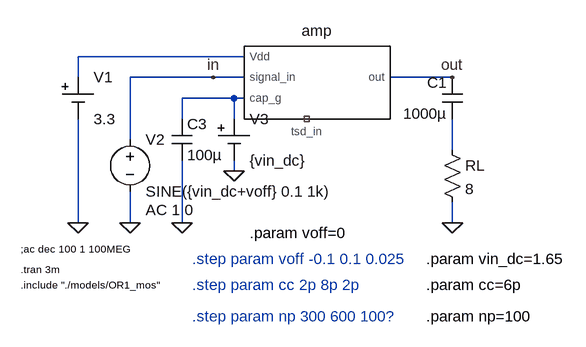
[diagram p0: schematic haruna_ab_test_tb.asc]
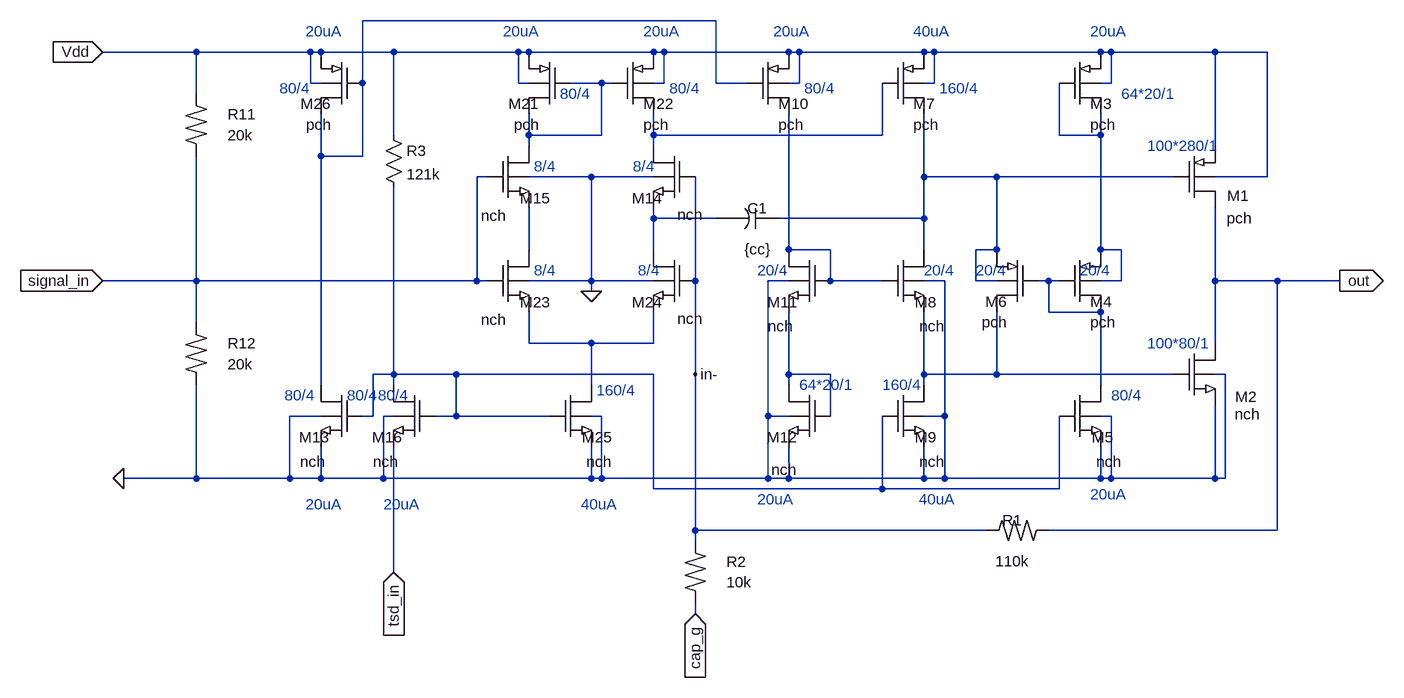
[diagram p1: sub-circuit haruna_ab.asc]
haruna_ab_test_tb.asc, the LTspice schematic file:
Version 4
SHEET 1 1492 1024
WIRE -240 -48 -496 -48
WIRE -496 -16 -496 -48
WIRE -288 -16 -416 -16
WIRE -240 -16 -288 -16
WIRE 80 -16 -16 -16
WIRE -256 16 -336 16
WIRE -240 16 -256 16
WIRE -336 48 -336 16
WIRE -256 48 -256 16
WIRE -416 80 -416 -16
WIRE 80 96 80 48
WIRE -256 128 -256 112
WIRE -496 208 -496 48
WIRE -416 208 -416 160
WIRE -336 208 -336 112
WIRE 80 208 80 176
FLAG -496 208 0
FLAG -336 208 0
FLAG -416 208 0
FLAG 80 208 0
FLAG 80 -16 out
FLAG -288 -16 in
FLAG -256 128 0
SYMBOL Misc\\cell -496 -16 R0
WINDOW 123 0 0 Left 2
WINDOW 39 0 0 Left 2
SYMATTR InstName V1
SYMATTR Value 3.3
SYMBOL cap 96 48 R180
WINDOW 0 24 56 Left 2
WINDOW 3 24 8 Left 2
SYMATTR InstName C1
SYMATTR Value 1000µ
SYMBOL voltage -416 64 R0
WINDOW 123 24 124 Left 2
WINDOW 39 0 0 Left 2
SYMATTR Value2 AC 1 0
SYMATTR InstName V2
SYMATTR Value SINE({vin_dc+voff} 0.1 1k)
SYMBOL haruna_ab -128 -16 R0
SYMATTR InstName amp
SYMBOL cap -352 48 R0
SYMATTR InstName C3
SYMATTR Value 100µ
SYMBOL res 64 80 R0
SYMATTR InstName RL
SYMATTR Value 8
SYMBOL Misc\\cell -256 48 R0
WINDOW 123 0 0 Left 2
WINDOW 39 0 0 Left 2
SYMATTR InstName V3
SYMATTR Value {vin_dc}
TEXT -584 280 Left 1 !.tran 3m
TEXT -584 304 Left 1 !.include "./models/OR1_mos"
TEXT -584 248 Left 1 !;ac dec 100 1 100MEG
TEXT -320 304 Left 2 ;.step param cc 2p 8p 2p
TEXT 40 304 Left 2 !.param cc=6p
TEXT -320 352 Left 2 ;.step param np 300 600 100?
TEXT 40 352 Left 2 !.param np=100
TEXT 40 264 Left 2 !.param vin_dc=1.65
TEXT -320 264 Left 2 ;.step param voff -0.1 0.1 0.025
TEXT -232 224 Left 2 !.param voff=0

haruna_ab.asc, the sub-circuit schematic file:
Version 4
SHEET 1 1492 1024
WIRE 32 -400 -512 -400
WIRE -768 -352 -912 -352
WIRE -592 -352 -768 -352
WIRE -576 -352 -592 -352
WIRE -464 -352 -576 -352
WIRE -272 -352 -464 -352
WIRE -256 -352 -272 -352
WIRE -64 -352 -256 -352
WIRE -48 -352 -64 -352
WIRE 144 -352 -48 -352
WIRE 160 -352 144 -352
WIRE 352 -352 160 -352
WIRE 368 -352 352 -352
WIRE 624 -352 368 -352
WIRE 640 -352 624 -352
WIRE 800 -352 640 -352
WIRE 880 -352 800 -352
WIRE -592 -304 -592 -352
WIRE -576 -304 -592 -304
WIRE -512 -304 -512 -400
WIRE -272 -304 -272 -352
WIRE -256 -304 -272 -304
WIRE -144 -304 -192 -304
WIRE -128 -304 -144 -304
WIRE -48 -304 -48 -352
WIRE -48 -304 -64 -304
WIRE 32 -304 32 -400
WIRE 80 -304 32 -304
WIRE 160 -304 160 -352
WIRE 160 -304 144 -304
WIRE 368 -304 368 -352
WIRE 368 -304 352 -304
WIRE 640 -304 640 -352
WIRE 640 -304 624 -304
WIRE -768 -288 -768 -352
WIRE -464 -224 -464 -352
WIRE -256 -224 -256 -256
WIRE -144 -224 -144 -304
WIRE -144 -224 -256 -224
WIRE -64 -224 -64 -256
WIRE 288 -224 288 -304
WIRE 288 -224 -64 -224
WIRE 560 -224 560 -304
WIRE 624 -224 624 -256
WIRE 624 -224 560 -224
WIRE -256 -208 -256 -224
WIRE -64 -208 -64 -224
WIRE 800 -208 800 -352
WIRE -576 -192 -576 -256
WIRE -512 -192 -512 -304
WIRE -512 -192 -576 -192
WIRE -320 -160 -336 -160
WIRE -160 -160 -256 -160
WIRE -64 -160 -160 -160
WIRE 352 -160 352 -256
WIRE 464 -160 352 -160
WIRE 736 -160 464 -160
WIRE 880 -160 880 -352
WIRE 880 -160 800 -160
WIRE -64 -96 -64 -112
WIRE 32 -96 -64 -96
WIRE 352 -96 352 -160
WIRE 352 -96 128 -96
WIRE -256 -48 -256 -112
WIRE -64 -48 -64 -96
WIRE 144 -48 144 -256
WIRE 208 -48 144 -48
WIRE 352 -48 352 -96
WIRE 464 -48 464 -160
WIRE 464 -48 432 -48
WIRE 624 -48 624 -224
WIRE 656 -48 624 -48
WIRE -768 0 -768 -192
WIRE -768 0 -912 0
WIRE -336 0 -336 -160
WIRE -336 0 -768 0
WIRE -320 0 -336 0
WIRE -160 0 -160 -160
WIRE -160 0 -256 0
WIRE -64 0 -160 0
WIRE 0 0 0 -160
WIRE 144 0 112 0
WIRE 208 0 208 -48
WIRE 208 0 192 0
WIRE 288 0 208 0
WIRE 384 0 352 0
WIRE 432 0 432 -48
WIRE 464 0 432 0
WIRE 544 0 528 0
WIRE 560 0 544 0
WIRE 656 0 656 -48
WIRE 656 0 624 0
WIRE 800 0 800 -112
WIRE 896 0 800 0
WIRE 992 0 896 0
WIRE -160 16 -160 0
WIRE 544 48 544 0
WIRE 624 48 544 48
WIRE -768 64 -768 0
WIRE -256 96 -256 48
WIRE -160 96 -256 96
WIRE -64 96 -64 48
WIRE -64 96 -160 96
WIRE 800 96 800 0
WIRE -464 144 -464 -144
WIRE -464 144 -496 144
WIRE -368 144 -464 144
WIRE -64 144 -368 144
WIRE 0 144 0 0
WIRE 144 144 144 48
WIRE 208 144 144 144
WIRE 352 144 352 48
WIRE 464 144 464 48
WIRE 464 144 352 144
WIRE 736 144 464 144
WIRE 816 144 800 144
WIRE -576 160 -576 -192
WIRE -464 160 -464 144
WIRE -160 160 -160 96
WIRE 144 160 144 144
WIRE 352 160 352 144
WIRE 624 160 624 48
WIRE -576 208 -624 208
WIRE -496 208 -496 144
WIRE -496 208 -512 208
WIRE -464 208 -480 208
WIRE -368 208 -368 144
WIRE -368 208 -400 208
WIRE -224 208 -368 208
WIRE -144 208 -160 208
WIRE 112 208 112 0
WIRE 144 208 112 208
WIRE 208 208 208 144
WIRE 384 208 384 0
WIRE 384 208 352 208
WIRE 640 208 624 208
WIRE -768 304 -768 160
WIRE -768 304 -880 304
WIRE -624 304 -624 208
WIRE -624 304 -768 304
WIRE -576 304 -576 256
WIRE -576 304 -624 304
WIRE -480 304 -480 208
WIRE -480 304 -576 304
WIRE -160 304 -160 256
WIRE -160 304 -480 304
WIRE -144 304 -144 208
WIRE -144 304 -160 304
WIRE 112 304 112 208
WIRE 112 304 -144 304
WIRE 144 304 144 256
WIRE 144 304 112 304
WIRE 352 304 352 256
WIRE 352 304 144 304
WIRE 384 304 384 208
WIRE 384 304 352 304
WIRE 624 304 624 256
WIRE 624 304 384 304
WIRE 640 304 640 208
WIRE 640 304 624 304
WIRE 800 304 800 192
WIRE 800 304 640 304
WIRE 816 304 816 144
WIRE 816 304 800 304
WIRE -64 320 -64 144
WIRE 288 320 288 208
WIRE 288 320 -64 320
WIRE 560 320 560 208
WIRE 560 320 288 320
WIRE 0 384 0 144
WIRE 448 384 0 384
WIRE 896 384 896 0
WIRE 896 384 544 384
WIRE 0 400 0 384
WIRE -464 448 -464 256
WIRE 0 512 0 496
FLAG -160 16 0
FLAG 992 0 out
IOPIN 992 0 Out
FLAG -912 -352 Vdd
IOPIN -912 -352 In
FLAG -912 0 signal_in
IOPIN -912 0 In
FLAG 0 512 cap_g
IOPIN 0 512 In
FLAG -880 304 0
FLAG 0 144 in-
FLAG -464 448 tsd_in
IOPIN -464 448 In
DATAFLAG 976 0 ""
SYMBOL NMOS_OR1 0 0 M0
WINDOW 3 -12 58 Left 2
SYMATTR InstName M24
SYMATTR Value2 l=4u w=8u ad={2u*8u} as={2u*8u} pd={4u+8u} ps={4u+8u}
SYMBOL NMOS_OR1 -320 0 R0
WINDOW 3 -10 60 Left 2
SYMATTR InstName M23
SYMATTR Value2 l=4u w=8u ad={2u*8u} as={2u*8u} pd={4u+8u} ps={4u+8u}
SYMBOL NMOS_OR1 -224 208 R0
WINDOW 3 57 70 Left 2
SYMATTR InstName M25
SYMATTR Value2 l=4u w=80u ad={2u*80u} as={2u*80u} pd={4u+80u} ps={4u+80u} m=2
SYMBOL PMOS_OR1 -128 -304 R0
SYMATTR InstName M22
SYMATTR Value2 l=4u w=80u ad={2u*80u} as={2u*80u} pd={4u+80u} ps={4u+80u}
SYMBOL PMOS_OR1 -192 -304 M0
SYMATTR InstName M21
SYMATTR Value2 l=4u w=80u ad={2u*80u} as={2u*80u} pd={4u+80u} ps={4u+80u}
SYMBOL PMOS_OR1 288 -304 R0
SYMATTR InstName M7
SYMATTR Value2 l=4u w=80u ad={2u*80u} as={2u*80u} pd={4u+80u} ps={4u+80u} m=2
SYMBOL NMOS_OR1 288 208 R0
WINDOW 3 57 70 Left 2
SYMATTR InstName M9
SYMATTR Value2 l=4u w=80u ad={2u*80u} as={2u*80u} pd={4u+80u} ps={4u+80u} m=2
SYMBOL NMOS_OR1 736 144 R0
WINDOW 3 94 61 Left 2
WINDOW 0 95 34 Left 2
SYMATTR InstName M2
SYMATTR Value2 l=1u w=80u ad={2u*80u} as={2u*80u} pd={4u+80u} ps={4u+80u} m={np}
SYMBOL PMOS_OR1 560 -304 R0
SYMATTR InstName M3
SYMATTR Value2 l=1u w=20u ad={2u*20u} as={2u*20u} pd={4u+20u} ps={4u+20u} m=64
SYMBOL NMOS_OR1 208 208 M0
WINDOW 3 52 83 Left 2
SYMATTR InstName M12
SYMATTR Value2 l=1u w=20u ad={2u*20u} as={2u*20u} pd={4u+20u} ps={4u+20u} m=64
SYMBOL NMOS_OR1 208 0 M0
WINDOW 3 57 70 Left 2
SYMATTR InstName M11
SYMATTR Value2 l=4u w=20u ad={2u*20u} as={2u*20u} pd={4u+20u} ps={4u+20u}
SYMBOL NMOS_OR1 288 0 R0
WINDOW 3 57 70 Left 2
SYMATTR InstName M8
SYMATTR Value2 l=4u w=20u ad={2u*20u} as={2u*20u} pd={4u+20u} ps={4u+20u}
SYMBOL PMOS_OR1 528 0 M0
SYMATTR InstName M6
SYMATTR Value2 l=4u w=80u ad={2u*80u} as={2u*80u} pd={4u+80u} ps={4u+80u}
SYMBOL PMOS_OR1 560 0 R0
SYMATTR InstName M4
SYMATTR Value2 l=4u w=80u ad={2u*80u} as={2u*80u} pd={4u+80u} ps={4u+80u}
SYMBOL PMOS_OR1 736 -160 R0
WINDOW 0 83 29 Left 2
WINDOW 3 82 64 Left 2
SYMATTR InstName M1
SYMATTR Value2 l=1u w=280u ad={2u*280u} as={2u*280u} pd={4u+280u} ps={4u+280u} m={np}
SYMBOL NMOS_OR1 560 208 R0
WINDOW 3 57 70 Left 2
SYMATTR InstName M5
SYMATTR Value2 l=4u w=80u ad={2u*80u} as={2u*80u} pd={4u+80u} ps={4u+80u}
SYMBOL PMOS_OR1 -512 -304 M0
SYMATTR InstName M26
SYMATTR Value2 l=4u w=80u ad={2u*80u} as={2u*80u} pd={4u+80u} ps={4u+80u}
SYMBOL PMOS_OR1 80 -304 R0
SYMATTR InstName M10
SYMATTR Value2 l=4u w=80u ad={2u*80u} as={2u*80u} pd={4u+80u} ps={4u+80u}
SYMBOL RES_OR1 0 400 R0
WINDOW 0 48 32 Left 2
WINDOW 3 48 64 Left 2
SYMATTR InstName R2
SYMATTR Value 10k
SYMBOL RES_OR1 544 384 R90
WINDOW 0 0 56 VBottom 2
WINDOW 3 32 56 VTop 2
SYMATTR InstName R1
SYMATTR Value 110k
SYMBOL RES_OR1 -768 -288 R0
WINDOW 0 48 32 Left 2
WINDOW 3 48 64 Left 2
SYMATTR InstName R11
SYMATTR Value 20k
SYMBOL RES_OR1 -768 64 R0
WINDOW 0 48 32 Left 2
WINDOW 3 48 64 Left 2
SYMATTR InstName R12
SYMATTR Value 20k
SYMBOL NMOS_OR1 -512 208 M0
WINDOW 3 57 70 Left 2
SYMATTR InstName M13
SYMATTR Value2 l=4u w=80u ad={2u*80u} as={2u*80u} pd={4u+80u} ps={4u+80u}
SYMBOL CAP_OR1 128 -96 R90
WINDOW 0 0 32 VBottom 2
WINDOW 3 32 32 VTop 2
SYMATTR InstName C1
SYMATTR Value {cc}
SYMBOL NMOS_OR1 0 -160 M0
WINDOW 3 -12 58 Left 2
SYMATTR InstName M14
SYMATTR Value2 l=4u w=8u ad={2u*8u} as={2u*8u} pd={4u+8u} ps={4u+8u}
SYMBOL NMOS_OR1 -320 -160 R0
WINDOW 3 -10 60 Left 2
SYMATTR InstName M15
SYMATTR Value2 l=4u w=8u ad={2u*8u} as={2u*8u} pd={4u+8u} ps={4u+8u}
SYMBOL res -480 -240 R0
WINDOW 0 36 40 Left 2
WINDOW 3 36 76 Left 2
SYMATTR InstName R3
SYMATTR Value 121k
SYMBOL NMOS_OR1 -400 208 M0
WINDOW 3 57 70 Left 2
SYMATTR InstName M16
SYMATTR Value2 l=4u w=80u ad={2u*80u} as={2u*80u} pd={4u+80u} ps={4u+80u}
TEXT -600 -384 Left 2 ;20uA
TEXT -296 -384 Left 2 ;20uA
TEXT -80 -384 Left 2 ;20uA
TEXT 120 -384 Left 2 ;20uA
TEXT 608 -384 Left 2 ;20uA
TEXT 336 -384 Left 2 ;40uA
TEXT -600 344 Left 2 ;20uA
TEXT -176 344 Left 2 ;40uA
TEXT -480 344 Left 2 ;20uA
TEXT 96 336 Left 2 ;20uA
TEXT 344 336 Left 2 ;40uA
TEXT 608 328 Left 2 ;20uA
TEXT -632 176 Left 2 ;80/4
TEXT -488 176 Left 2 ;80/4
TEXT 288 160 Left 2 ;160/4
TEXT 640 176 Left 2 ;80/4
TEXT -152 168 Left 2 ;160/4
TEXT 376 -296 Left 2 ;160/4
TEXT 168 -296 Left 2 ;80/4
TEXT -40 -296 Left 2 ;80/4
TEXT -208 -288 Left 2 ;80/4
TEXT -640 -296 Left 2 ;80/4
TEXT 160 160 Left 2 ;64*20/1
TEXT 656 -288 Left 2 ;64*20/1
TEXT 696 -208 Left 2 ;100*280/1
TEXT 696 96 Left 2 ;100*80/1
TEXT -248 -176 Left 2 ;8/4
TEXT -96 -176 Left 2 ;8/4
TEXT -88 -16 Left 2 ;8/4
TEXT -248 -16 Left 2 ;8/4
TEXT 96 -16 Left 2 ;20/4
TEXT 352 -16 Left 2 ;20/4
TEXT 432 -16 Left 2 ;20/4
TEXT 592 -16 Left 2 ;20/4
TEXT -536 176 Left 2 ;80/4

The netlist it stands for:
* haruna_ab_test_tb.asc
V1 N001 0 3.3
C1 N003 out 1000µ
V2 in 0 SINE({vin_dc+voff} 0.1 1k) AC 1 0
Xamp N002 in N001 out NC_01 haruna_ab
C3 N002 0 100µ
RL N003 0 8
V3 N002 0 {vin_dc}

* block symbol definitions
.subckt haruna_ab cap_g signal_in Vdd out tsd_in
M24 N006 in- N010 0 nch l=4u w=8u ad={2u*8u} as={2u*8u} pd={4u+8u} ps={4u+8u}
M23 N007 signal_in N010 0 nch l=4u w=8u ad={2u*8u} as={2u*8u} pd={4u+8u} ps={4u+8u}
M25 N010 N011 0 0 nch l=4u w=80u ad={2u*80u} as={2u*80u} pd={4u+80u} ps={4u+80u} m=2
M22 N003 N002 Vdd Vdd pch l=4u w=80u ad={2u*80u} as={2u*80u} pd={4u+80u} ps={4u+80u}
M21 N002 N002 Vdd Vdd pch l=4u w=80u ad={2u*80u} as={2u*80u} pd={4u+80u} ps={4u+80u}
M7 N005 N003 Vdd Vdd pch l=4u w=80u ad={2u*80u} as={2u*80u} pd={4u+80u} ps={4u+80u} m=2
M9 N013 N011 0 0 nch l=4u w=80u ad={2u*80u} as={2u*80u} pd={4u+80u} ps={4u+80u} m=2
M2 out N013 0 0 nch l=1u w=80u ad={2u*80u} as={2u*80u} pd={4u+80u} ps={4u+80u} m={np}
M3 N004 N004 Vdd Vdd pch l=1u w=20u ad={2u*20u} as={2u*20u} pd={4u+20u} ps={4u+20u} m=64
M12 N012 N012 0 0 nch l=1u w=20u ad={2u*20u} as={2u*20u} pd={4u+20u} ps={4u+20u} m=64
M11 N008 N008 N012 0 nch l=4u w=20u ad={2u*20u} as={2u*20u} pd={4u+20u} ps={4u+20u}
M8 N005 N008 N013 0 nch l=4u w=20u ad={2u*20u} as={2u*20u} pd={4u+20u} ps={4u+20u}
M6 N013 N009 N005 N005 pch l=4u w=80u ad={2u*80u} as={2u*80u} pd={4u+80u} ps={4u+80u}
M4 N009 N009 N004 N004 pch l=4u w=80u ad={2u*80u} as={2u*80u} pd={4u+80u} ps={4u+80u}
M1 out N005 Vdd Vdd pch l=1u w=280u ad={2u*280u} as={2u*280u} pd={4u+280u} ps={4u+280u} m={np}
M5 N009 N011 0 0 nch l=4u w=80u ad={2u*80u} as={2u*80u} pd={4u+80u} ps={4u+80u}
M26 N001 N001 Vdd Vdd pch l=4u w=80u ad={2u*80u} as={2u*80u} pd={4u+80u} ps={4u+80u}
M10 N008 N001 Vdd Vdd pch l=4u w=80u ad={2u*80u} as={2u*80u} pd={4u+80u} ps={4u+80u}
R2 in- cap_g 10k
R1 out in- 110k
R11 Vdd signal_in 20k
R12 signal_in 0 20k
M13 N001 N011 0 0 nch l=4u w=80u ad={2u*80u} as={2u*80u} pd={4u+80u} ps={4u+80u}
C1 N005 N006 {cc}
M14 N003 in- N006 0 nch l=4u w=8u ad={2u*8u} as={2u*8u} pd={4u+8u} ps={4u+8u}
M15 N002 signal_in N007 0 nch l=4u w=8u ad={2u*8u} as={2u*8u} pd={4u+8u} ps={4u+8u}
R3 Vdd N011 121k
M16 N011 N011 tsd_in 0 nch l=4u w=80u ad={2u*80u} as={2u*80u} pd={4u+80u} ps={4u+80u}
* 20uA
* 20uA
* 20uA
* 20uA
* 20uA
* 40uA
* 20uA
* 40uA
* 20uA
* 20uA
* 40uA
* 20uA
* 80/4
* 80/4
* 160/4
* 80/4
* 160/4
* 160/4
* 80/4
* 80/4
* 80/4
* 80/4
* 64*20/1
* 64*20/1
* 100*280/1
* 100*80/1
* 8/4
* 8/4
* 8/4
* 8/4
* 20/4
* 20/4
* 20/4
* 20/4
* 80/4
.ends haruna_ab

.model NMOS NMOS
.model PMOS PMOS
.lib standard.mos
.tran 3m
.include "./models/OR1_mos"
;ac dec 100 1 100MEG
* .step param cc 2p 8p 2p
.param cc=6p
* .step param np 300 600 100?
.param np=100
.param vin_dc=1.65
* .step param voff -0.1 0.1 0.025
.param voff=0
.backanno
.end